# EAGLE schematic proper schematic (EAGLE 9.6.2)
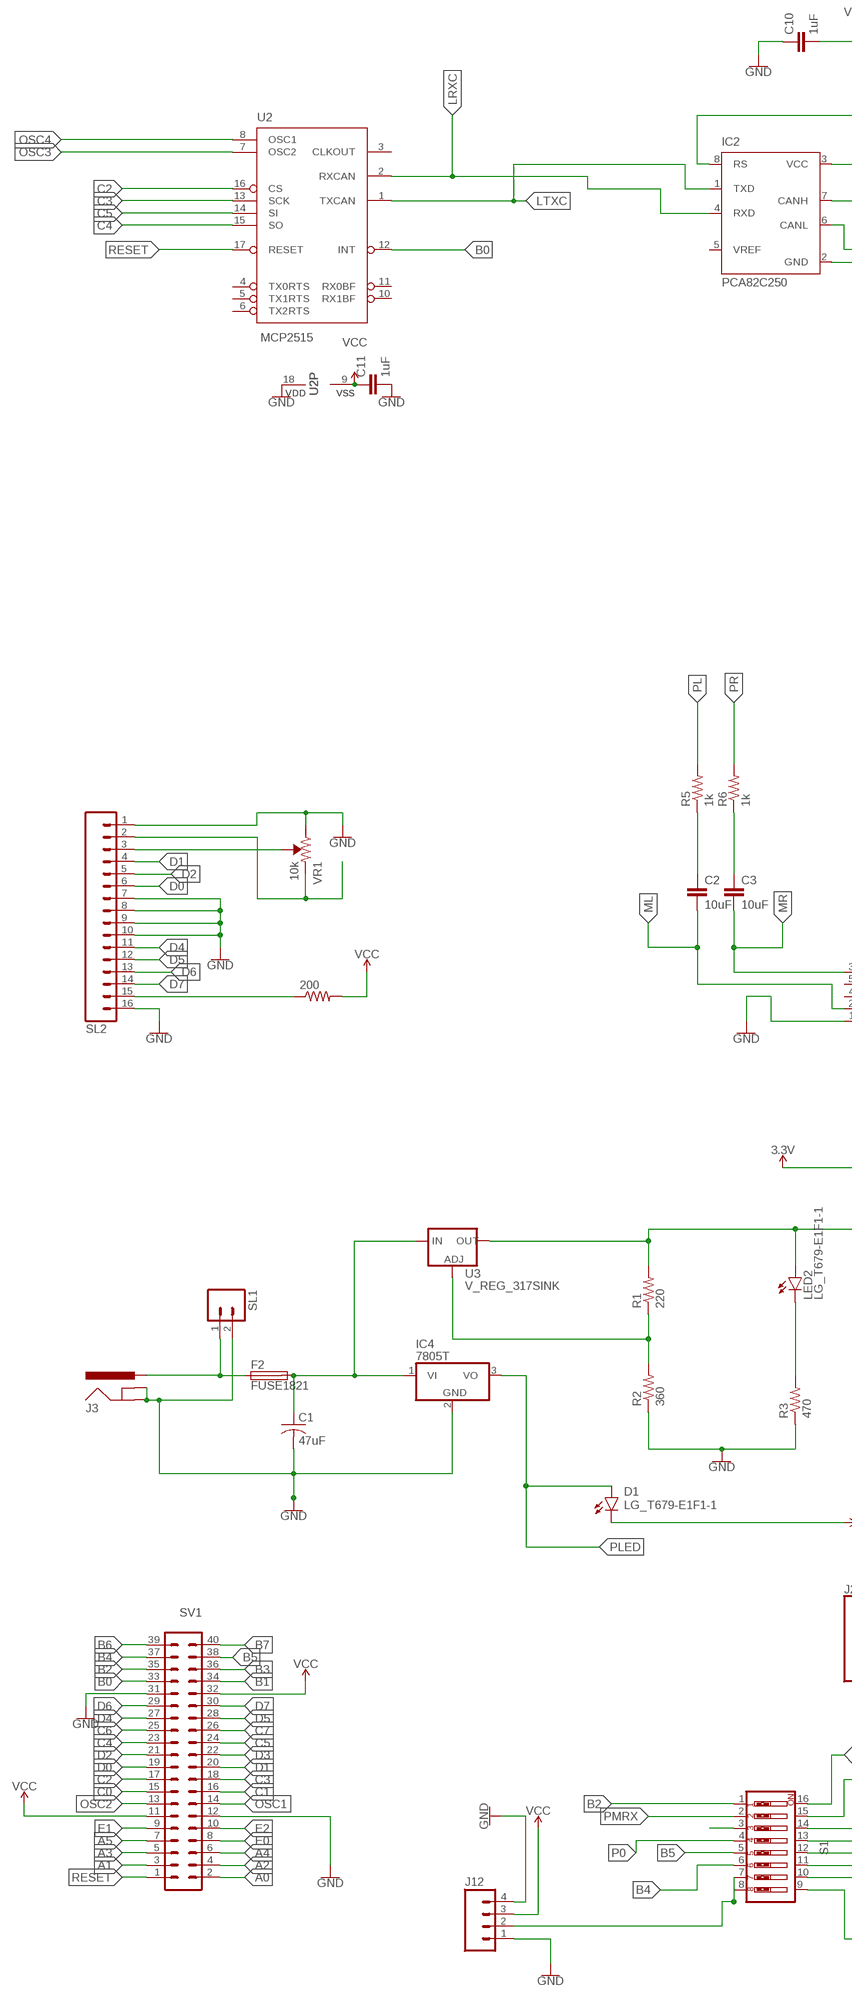
[diagram p0: schematic, sheet 1, part 1 of 2]
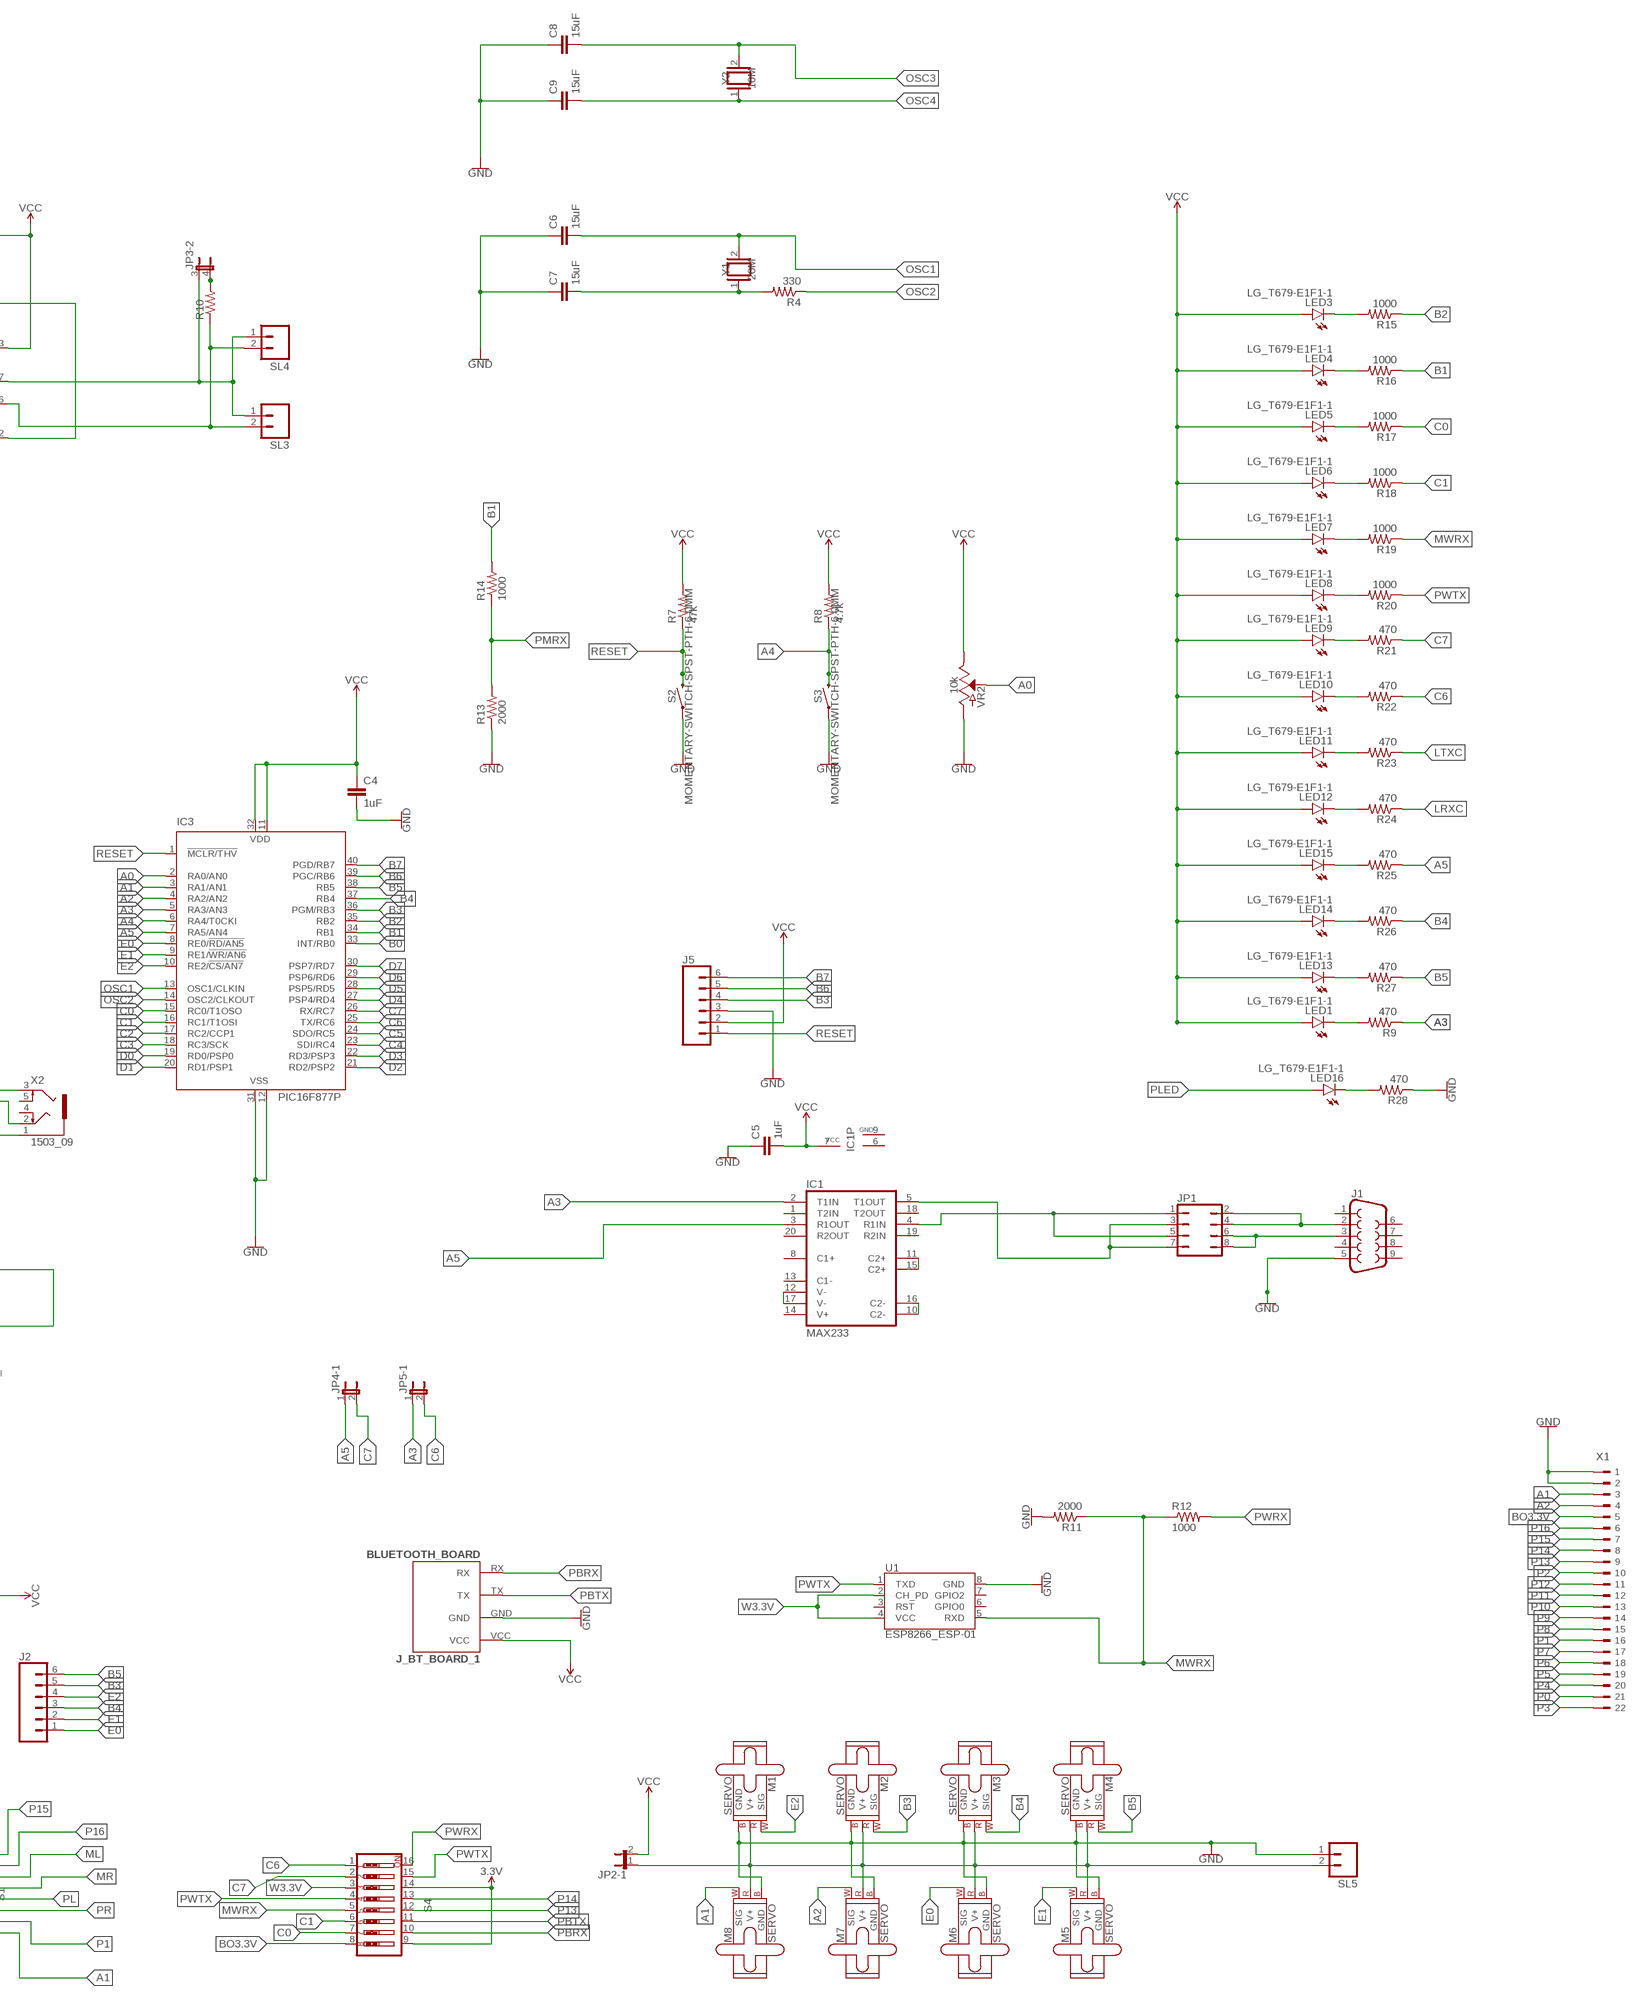
[diagram p1: schematic, sheet 1, part 2 of 2]

## Parts
200  R-US_0204/5  [0204/5]
C1  47uF  C-US025-025X050  [C025-025X050]
C2  10uF  C2,5-3  [C2.5-3]
C3  10uF  C2,5-3  [C2.5-3]
C4  1uF  C2,5-3  [C2.5-3]
C5  1uF  C2,5-3  [C2.5-3]
C6  15uF  C2,5-3  [C2.5-3]
C7  15uF  C2,5-3  [C2.5-3]
C8  15uF  C2,5-3  [C2.5-3]
C9  15uF  C2,5-3  [C2.5-3]
C10  1uF  C2,5-3  [C2.5-3]
C11  1uF  C2,5-3  [C2.5-3]
D1  LG_T679-E1F1-1  [PLCC2]
F2  FUSE1821  [FUSE_HOLDER_MENTOR-1821]
IC1  MAX233  [DIL20]
IC2  PCA82C250  [DIL08]
IC3  PIC16F877P  [DIL40]
IC4  7805T  [TO220H]
J1  DB9FEMALE  [DB9]
J2  CONN_062.5MM-6-90  [1X06_SCREW_TERMINAL_BLOCK]
J3  POWER_JACK  [POWER_JACK_PTH]
J5  CONN_062.5MM-6-90  [1X06_SCREW_TERMINAL_BLOCK]
J12  M04  [04P]
J_BT_BOARD_1  BLUETOOTH_BOARD  [BT_BOARD_FOOTPRINT]
JP1  JP4Q  [JP4Q]
JP2  JP2QE  [JP2Q]
JP3  JP2QE  [JP2Q]
JP4  JP2QE  [JP2Q]
JP5  JP2QE  [JP2Q]
LED1  LG_T679-E1F1-1  [PLCC2]
LED2  LG_T679-E1F1-1  [PLCC2]
LED3  LG_T679-E1F1-1  [PLCC2]
LED4  LG_T679-E1F1-1  [PLCC2]
LED5  LG_T679-E1F1-1  [PLCC2]
LED6  LG_T679-E1F1-1  [PLCC2]
LED7  LG_T679-E1F1-1  [PLCC2]
LED8  LG_T679-E1F1-1  [PLCC2]
LED9  LG_T679-E1F1-1  [PLCC2]
LED10  LG_T679-E1F1-1  [PLCC2]
LED11  LG_T679-E1F1-1  [PLCC2]
LED12  LG_T679-E1F1-1  [PLCC2]
LED13  LG_T679-E1F1-1  [PLCC2]
LED14  LG_T679-E1F1-1  [PLCC2]
LED15  LG_T679-E1F1-1  [PLCC2]
LED16  LG_T679-E1F1-1  [PLCC2]
M1  SERVO  [1X03]
M2  SERVO  [1X03]
M3  SERVO  [1X03]
M4  SERVO  [1X03]
M5  SERVO  [1X03]
M6  SERVO  [1X03]
M7  SERVO  [1X03]
M8  SERVO  [1X03]
R1  220  R-US_0204/5  [0204/5]
R2  360  R-US_0204/5  [0204/5]
R3  470  R-US_0204/5  [0204/5]
R4  330  R-US_0204/5  [0204/5]
R5  1k  R-US_0204/5  [0204/5]
R6  1k  R-US_0204/5  [0204/5]
R7  47k  R-US_0204/5  [0204/5]
R8  4.7k  R-US_0204/5  [0204/5]
R9  470  R-US_0204/5  [0204/5]
R10  R-US_0204/5  [0204/5]
R11  2000  R-US_0204/5  [0204/5]
R12  1000  R-US_0204/5  [0204/5]
R13  2000  R-US_0204/5  [0204/5]
R14  1000  R-US_0204/5  [0204/5]
R15  1000  R-US_0204/5  [0204/5]
R16  1000  R-US_0204/5  [0204/5]
R17  1000  R-US_0204/5  [0204/5]
R18  1000  R-US_0204/5  [0204/5]
R19  1000  R-US_0204/5  [0204/5]
R20  1000  R-US_0204/5  [0204/5]
R21  470  R-US_0204/5  [0204/5]
R22  470  R-US_0204/5  [0204/5]
R23  470  R-US_0204/5  [0204/5]
R24  470  R-US_0204/5  [0204/5]
R25  470  R-US_0204/5  [0204/5]
R26  470  R-US_0204/5  [0204/5]
R27  470  R-US_0204/5  [0204/5]
R28  470  R-US_0204/5  [0204/5]
S1  SW_DIP-8  [EDG-08]
S2  MOMENTARY-SWITCH-SPST-PTH-6.0MM  [TACTILE_SWITCH_PTH_6.0MM]
S3  MOMENTARY-SWITCH-SPST-PTH-6.0MM  [TACTILE_SWITCH_PTH_6.0MM]
S4  SW_DIP-8  [EDG-08]
SL1  M02  [02P]
SL2  M16  [16P]
SL3  M02  [02P]
SL4  M02  [02P]
SL5  M02  [02P]
SV1  MA20-2  [MA20-2]
U1  ESP8266_ESP-01  [ESP8266_ESP-01]
U2  MCP2515  MCP2515(MCP2510)P  [DIP18]
U3  V_REG_317SINK  [TO220-ADJ]
VR1  10k  TRIMPOT-PTH-10MM-KNOB-1/2W-10%  [TRIMPOT-PTH-3386U]
VR2  10k  POTENTIOMETER-PTH-9MM-1/20W-20%  [POT-PTH-ALPS]
X1  180G-22  [180G-22]
X2  1503_09  [1503_09]
Y1  20M  XTAL/S  [QS]
Y2  16M  XTAL/S  [QS]

## Nets
3.3V: LED2.A R1.2 S4.9 S4.14 U3.OUT
A0: IC3.2(RA0/AN0) SV1.2 VR2.P$2(S) VR2.P$3(A) ; supply symbol labelled GND
A1: IC3.3(RA1/AN1) M8.1(SIG) S1.9 SV1.3 X1.3
A2: IC3.4(RA2/AN2) M7.1(SIG) SV1.4 X1.4
A3: IC1.2(T1IN) IC3.5(RA3/AN3) JP5.1 R9.1 SV1.5
A4: IC3.6(RA4/T0CKI) R8.1 S3.3 SV1.6
A5: IC1.3(R1OUT) IC3.7(RA5/AN4) JP4.1 R25.1 SV1.7
B0: IC3.33(INT/RB0) SV1.33 U2.12(INT)
B1: IC3.34(RB1) R14.2 R16.1 SV1.34
B2: IC3.35(RB2) R15.1 S1.1 SV1.35
B3: IC3.36(PGM/RB3) J2.5 J5.4 M2.1(SIG) SV1.36
B4: IC3.37(RB4) J2.3 M3.1(SIG) R26.1 S1.6 SV1.37
B5: IC3.38(RB5) J2.6 M4.1(SIG) R27.1 S1.5 SV1.38
B6: IC3.39(PGC/RB6) J5.5 SV1.39
B7: IC3.40(PGD/RB7) J5.6 SV1.40
BO3.3V: S4.8 X1.5
C0: IC3.15(RC0/T1OSO) R17.1 S4.7 SV1.15
C1: IC3.16(RC1/T1OSI) R18.1 S4.6 SV1.16
C2: IC3.17(RC2/CCP1) SV1.17 U2.16(CS)
C3: IC3.18(RC3/SCK) SV1.18 U2.13(SCK)
C4: IC3.23(SDI/RC4) SV1.23 U2.15(SO)
C5: IC3.24(SDO/RC5) SV1.24 U2.14(SI)
C6: IC3.25(TX/RC6) JP5.2 R22.1 S4.1 SV1.25
C7: IC3.26(RX/RC7) JP4.2 R21.1 S4.2 SV1.26
D0: IC3.19(RD0/PSP0) SL2.6 SV1.19
D1: IC3.20(RD1/PSP1) SL2.4 SV1.20
D2: IC3.21(RD2/PSP2) SL2.5 SV1.21
D3: IC3.22(RD3/PSP3) SV1.22
D4: IC3.27(PSP4/RD4) SL2.11 SV1.27
D5: IC3.28(PSP5/RD5) SL2.12 SV1.28
D6: IC3.29(PSP6/RD6) SL2.13 SV1.29
D7: IC3.30(PSP7/RD7) SL2.14 SV1.30
E0: IC3.8(RE0/!RD/AN5) J2.1 M6.1(SIG) SV1.8
E1: IC3.9(RE1/!WR/AN6) J2.2 M5.1(SIG) SV1.9
E2: IC3.10(RE2/!CS/AN7) J2.4 M1.1(SIG) SV1.10
GND: C1.2 C4.2 C5.1 C6.1 C7.1 C8.1 C9.1 C10.1 C11.2 IC3.12(VSS) IC3.31(VSS) IC4.2(GND) J1.5 J3.GND J3.GNDBREAK J5.3 J12.1 J12.4 J_BT_BOARD_1.GND M1.3(GND) M2.3(GND) M3.3(GND) M4.3(GND) M5.3(GND) M6.3(GND) M7.3(GND) M8.3(GND) R2.1 R3.1 R11.2 R13.1 R28.1 S2.1 S3.1 SL1.2 SL2.1 SL2.7 SL2.8 SL2.9 SL2.10 SL2.16 SL5.1 SV1.12 SV1.31 U1.8(GND) U2.18(VDD) VR1.3(CW) X1.1 X1.2 X2.1
LRXC: IC2.4(RXD) R24.1 U2.2(RXCAN)
LTXC: IC2.1(TXD) R23.1 U2.1(TXCAN)
ML: C2.2 S1.14 X2.2
MR: C3.2 S1.13 X2.3
MWRX: R11.1 R12.1 R19.1 S4.5 U1.5(RXD)
N$1: LED1.C R9.2
N$2: S1.3
N$5: JP3.4 R10.2
N$6: IC1.10(C2-) IC1.16(C2-)
N$7: C1.1 F2.B IC4.1(VI) U3.IN
N$9: F2.A J3.PWR SL1.1
N$10: R1.1 R2.2 U3.ADJ
N$12: LED2.C R3.2
N$14: IC1.5(T1OUT) JP1.3 JP1.7
N$15: IC1.4(R1IN) JP1.1 JP1.5
N$16: J1.3 JP1.6 JP1.8
N$18: J1.2 JP1.2 JP1.4
N$21: C2.1 R5.1
N$22: IC1.12(V-) IC1.17(V-)
N$23: IC1.11(C2+) IC1.15(C2+)
N$24: C3.1 R6.1
N$27: 200.1 SL2.15
N$28: C7.2 R4.2 Y1.1
N$29: SL2.3 VR1.2(WIPER)
N$30: SL2.2 VR1.1(CCW)
N$32: JP2.1 M1.2(V+) M2.2(V+) M3.2(V+) M4.2(V+) M5.2(V+) M6.2(V+) M7.2(V+) M8.2(V+) SL5.2
N$39: J12.2 S1.7 S1.8
N$42: IC2.2(GND) IC2.8(RS)
N$44: IC2.6(CANL) R10.1 SL3.2 SL4.2
N$45: IC2.7(CANH) JP3.3 SL3.1 SL4.1
N$47: LED3.C R15.2
N$50: LED4.C R16.2
N$52: LED5.C R17.2
N$53: LED6.C R18.2
N$55: LED7.C R19.2
N$57: LED8.C R20.2
N$59: LED9.C R21.2
N$61: LED10.C R22.2
N$63: LED11.C R23.2
N$65: LED12.C R24.2
N$67: LED15.C R25.2
N$69: LED14.C R26.2
N$71: LED13.C R27.2
N$73: LED16.C R28.2
OSC1: C6.2 IC3.13(OSC1/CLKIN) SV1.14 Y1.2
OSC2: IC3.14(OSC2/CLKOUT) R4.1 SV1.13
OSC3: C8.2 U2.7(OSC2) Y2.2
OSC4: C9.2 U2.8(OSC1) Y2.1
P0: S1.4 X1.21
P1: S1.10 X1.16
P2: X1.10
P3: X1.22
P4: X1.20
P5: X1.19
P6: X1.18
P7: X1.17
P8: X1.15
P9: X1.14
P10: X1.13
P11: X1.12
P12: X1.11
P13: S4.12 X1.9
P14: S4.13 X1.8
P15: S1.16 X1.7
P16: S1.15 X1.6
PBRX: J_BT_BOARD_1.RX S4.10
PBTX: J_BT_BOARD_1.TX S4.11
PL: R5.2 S1.12
PLED: D1.A IC4.3(VO) LED16.A
PMRX: R13.2 R14.1 S1.2
PR: R6.2 S1.11
PWRX: R12.2 S4.16
PWTX: R20.1 S4.4 S4.15 U1.1(TXD)
RESET: IC3.1(!MCLR/THV) J5.1 R7.1 S2.3 SV1.1 U2.17(RESET)
VCCA: 200.2 C4.1 C5.2 C10.2 C11.1 D1.C IC1.7(VCC) IC2.3(VCC) IC3.11(VDD) IC3.32(VDD) J5.2 J12.3 J_BT_BOARD_1.VCC JP2.2 LED1.A LED3.A LED4.A LED5.A LED6.A LED7.A LED8.A LED9.A LED10.A LED11.A LED12.A LED13.A LED14.A LED15.A R7.2 R8.2 SV1.11 SV1.32 U2.9(VSS) VR2.P$1(E) ; supply symbol labelled VCC
W3.3V: S4.3 U1.2(CH_PD) U1.4(VCC)
Unconnected: IC1.1(T2IN) IC1.8(C1+) IC1.13(C1-) IC1.14(V+) IC1.18(T2OUT) IC1.19(R2IN) IC1.20(R2OUT) IC2.5(VREF) J1.1 J1.4 J1.6 J1.7 J1.8 J1.9 JP2.3 JP2.4 JP3.1 JP3.2 JP4.3 JP4.4 JP5.3 JP5.4 U1.3(RST) U1.6(GPIO0) U1.7(GPIO2) U2.3(CLKOUT) U2.4(TX0RTS) U2.5(TX1RTS) U2.6(TX2RTS) U2.10(RX1BF) U2.11(RX0BF) X2.4 X2.5

## Power pins joined to a net without a drawn wire
GND: IC1.6(GND) IC1.9(GND)

## Library data of the parts
200 R1-R28 = rcl:R-US_: RESISTOR, American symbol; SPICEPREFIX: R
C1 = rcl:C-US: CAPACITOR, American symbol; SPICEPREFIX: C
C2-C11 = capacitor-wima:C: CAPACITOR naming: grid - package width
D1 LED1-LED16 = led:*_T679-?-1: LC TOPLED® Low Current LED Source: http://catalog.osram-os.com .. LG_LS_LY_T679_OBS.pdf; COLOR: green
F2 = fuse:FUSE: Fuse; OC_FARNELL: unknown; OC_NEWARK: unknown
IC1 = maxim:MAX233: RS232 TRANSCEIVER; MPN: MAX233ACPP+G36; OC_FARNELL: 1593332; OC_NEWARK: 89K3459
IC2 = micro-philips:PCA82C250: CAN CONTROLLER INTERFACE; OC_FARNELL: 3692358; OC_NEWARK: unknown
IC3 = microchip:PIC16F87*: MICROCONTROLLER; MF: MICROCHIP; MPN: PIC16F877-04/P; OC_FARNELL: 9761349; OC_NEWARK: 61K3463
IC4 = linear:78*: Positive VOLTAGE REGULATOR Source: http://cache.national.com/ds/LM/LM78L05.pdf http://www.fairchildsemi.com/ds/LM/LM7805.pdf
J1 = SparkFun-Connectors:DB9: DB9 Connector Standard DB9 (D-Sub 9) serial connector. Can be used for CAN bus as well as RS485 and RS232. Footprint production proven. Here is the female version connector we sell at SparkFun: 9 Pin Female Serial Connector - PCB Mount <https://www.sparkfun.com/products/429> (PRT-00429) This connector has been used on the following SparkFun products: SparkFun RS232 Shifter - SMD <https://www.sparkfun.com/products/449> (PRT-00449) SparkFun RS232 Shifter SMD (No DB9) <https://www.sparkfun.com/products/8780> (PRT-08780); PROD_ID: CONN-08194
J2 J5 = SparkFun-Connectors:CONN_06: Multi connection point. Often used as Generic Header-pin footprint for 0.1 inch spaced/style header connections On any of the 0.1 inch spaced packages, you can populate with these: Break Away Headers - Straight <https://www.sparkfun.com/products/116> (PRT-00116) Break Away Male Headers - Right Angle <https://www.sparkfun.com/products/553> (PRT-00553) Female Headers <https://www.sparkfun.com/products/115> (PRT-00115) Break Away Headers - Machine Pin <https://www.sparkfun.com/products/117> (PRT-00117) Break Away Female Headers - Swiss Machine Pin <https://www.sparkfun.com/products/743> (PRT-00743) Arduino Stackable Header - 6 Pin <https://www.sparkfun.com/products/9280> (PRT-09280) Screw Terminals 2.54mm Pitch (6-Pin) <https://www.sparkfun.com/products/16499> (PRT-16499) For SCREWTERMINALS and SPRING TERMINALS visit here: Screw Terimnals on SparkFun.com <https://www.sparkfun.com/search/results?term=Screw+Terminals> (5mm/3.5mm/2.54mm spacing) This device is also useful as a general connection point to wire up your design to another part of your project. Our various solder wires solder well into these plated through hole pads. Hook-Up Wire - Assortment (Stranded, 22 AWG) <https://www.sparkfun.com/products/11375> (PRT-11375) Hook-Up Wire - Assortment (Solid Core, 22 AWG) <https://www.sparkfun.com/products/11367> (PRT-11367) View the entire wire category on our website here <https://www.sparkfun.com/categories/141>
J3 = SparkFun-Connectors:POWER_JACK: Power Jack Connector This is the standard 5.5mm barrel jack for power. The PTH is the most common, proven, reliable, footprint. The Slot footprint only works if the mill layer is transmitted to the PCB fab house so be warned. Here are the connectors we sell at SparkFun: DC Barrel Power Jack/Connector <https://www.sparkfun.com/products/119> (PRT-00119) DC Barrel Power Jack/Connector (SMD) <https://www.sparkfun.com/products/12748> (PRT-12748) DC Barrel Jack Adapter - Breadboard Compatible <https://www.sparkfun.com/products/10811> (PRT-10811) It is used on this SparkFun product (and many, many others): SparkFun RedBoard - Programmed with Arduino <https://www.sparkfun.com/products/12757> (DEV-12757) Also, if you need a mating power supply or connector, please check these out: Wall Adapter Power Supply - 9VDC 650mA <https://www.sparkfun.com/products/298> (TOL-00298) DC Barrel Jack Adapter - Male <https://www.sparkfun.com/products/10287> (PRT-10287); PROD_ID: CONN-08197
J12 = con-amp-quick:M04: AMP QUICK CONNECTOR; OC_FARNELL: unknown; OC_NEWARK: unknown
J_BT_BOARD_1 = bluetooth:BLUETOOTH_BOARD: Bluetooth Board V1.05
JP1 = jumper:JP4Q: JUMPER
JP2-JP5 = jumper:JP2QE: JUMPER
M1-M8 = SparkFun-Electromechanical:SERVO: Servo Motor 3-pin connector for a standard servo motor (voltage supply, ground, and control signal.) SparkFun Products Servo - Generic (Sub-Micro Size) <https://www.sparkfun.com/products/9065> (ROB-09065) Servo - Generic High Torque Continuous Rotation (Standard Size) <https://www.sparkfun.com/products/9347> (ROB-09347) Servo - Generic High Torque (Standard Size) <https://www.sparkfun.com/products/11965> (ROB-11965)
S1 S4 = special:SW_DIP-8: DIP SWITCH
S2 S3 = SparkFun-Switches:MOMENTARY-SWITCH-SPST: Momentary Switch (Pushbutton) - SPST Normally-open (NO) SPST momentary switches (buttons, pushbuttons). Variants PTH-12MM - 12mm square, through-hole Momentary Pushbutton Switch - 12mm Square <https://www.sparkfun.com/products/9190> (COM-09190) PTH-6.0MM, PTH-6.0MM-KIT - 6.0mm square, through-hole Mini Pushbutton Switch <https://www.sparkfun.com/products/97> (COM-00097) KIT package intended for soldering kit's - only one side of pads' copper is exposed. PTH-RIGHT-ANGLE-KIT - Right-angle, through-hole Right Angle Tactile Button <https://www.sparkfun.com/products/10791> - Used on SparkFun BigTime Watch Kit <https://www.sparkfun.com/products/11734> SMD-12MM - 12mm square, surface-mount Tactile Button - SMD (12mm) <https://www.sparkfun.com/products/12993> (COM-12993) Used on SparkFun PicoBoard <https://www.sparkfun.com/products/11888> SMD-4.5MM - 4.5mm Square Trackball Switch Used on SparkFun Blackberry Trackballer Breakout <https://www.sparkfun.com/products/13169> SMD-4.6MMX2.8MM - 4.60mm x 2.80mm, surface mount Used on SparkFun Pro Micro - RP2040 <https://www.sparkfun.com/products/17717> SMD-5.2MM, SMD-5.2-REDUNDANT - 5.2mm square, surface-mount Mini Pushbutton Switch - SMD <https://www.sparkfun.com/products/8720> (COM-08720) Used on Arduino Pro Mini <https://www.sparkfun.com/products/11114> REDUNDANT package connects both switch circuits together SMD-6.0X3.5MM - 6.0 x 3.5mm, surface mount Momentary Reset Switch SMD <https://www.sparkfun.com/products/8229> (COM-08229) SMD-6.2MM-TALL - 6.2mm square, surface mount Tactile Button - SMD (6mm) <https://www.sparkfun.com/products/12992> Used on SparkFun Digital Sandbox <https://www.sparkfun.com/products/12651> SMD-RIGHT-ANGLE - Right-angle, surface mount Used on SparkFun Block for Intel® Edison - Arduino <https://www.sparkfun.com/products/13036>; PROD_ID: SWCH-08441; SF_SKU: COM-00097
SL1 SL3-SL5 = con-amp-quick:M02: AMP QUICK CONNECTOR; OC_FARNELL: unknown; OC_NEWARK: unknown
SL2 = con-amp-quick:M16: AMP QUICK CONNECTOR; OC_FARNELL: unknown; OC_NEWARK: unknown
SV1 = con-lstb:MA20-2: PIN HEADER; OC_FARNELL: unknown; OC_NEWARK: unknown
U1 = SparkFun-RF:ESP8266_ESP-01: ESP8266 ESP-01 Module The ESP8266 WiFi Module is a self contained SOC with integrated TCP/IP protocol stack that can give any microcontroller access to your WiFi network. The ESP8266 is capable of either hosting an application or offloading all Wi-Fi networking functions from another application processor. Each ESP8266 module comes pre-programmed with an AT command set firmware, meaning, you can simply hook this up to your Arduino device and get about as much WiFi-ability as a WiFi Shield offers (and that’s just out of the box)! The ESP8266 module is an extremely cost effective board with a huge, and ever growing, community. This module has a powerful enough on-board processing and storage capability that allows it to be integrated with the sensors and other application specific devices through its GPIOs with minimal development up-front and minimal loading during runtime. Its high degree of on-chip integration allows for minimal external circuitry, including the front-end module, is designed to occupy minimal PCB area. The ESP8266 supports APSD for VoIP applications and Bluetooth co-existance interfaces, it contains a self-calibrated RF allowing it to work under all operating conditions, and requires no external RF parts. SparkFun Product Page <https://www.sparkfun.com/products/13678>; SF_ID: WRL-13678
U2 = SparkFun-IC-Comms:MCP2515(MCP2510): CAN controller with SPI interface The MCP2515 controller supercedes the MCP2510 while addressing all errata associated with it. The two devices are pin compatible, either can be used with this device. 18-pin package SOIC Simple SPI interface to any MCU. One-shot mode ensures message transmission is attempted only once Databyte filtering Start-of-Frame (SOF) output Low-power CMOS Technology Datasheet <http://www.sparkfun.com/datasheets/DevTools/Arduino/MCP2515.pdf> SparkFun Products CAN-BUS Shield <https://www.sparkfun.com/products/13262> (DEV-13262); PROD_ID: NA-XXXXX
U3 = SparkFun-IC-Power:V_REG_317: Voltage Regulator Standard LM317 adjustable voltage regulator. AOI (Adjust Output Input). Google 'LM317 Calculator' for easy to use app to get the two resistor values needed. 240/720 for 5V output. 240/390 for 3.3V output. Spark Fun Electronics SKU : COM-00527
VR1 = SparkFun-Resistors:TRIMPOT: Trimming Potentiometer (Trimpot) Three-terminal potentiometers, with an adjustable wiper and two adjustable resistors. A pot can be used to create a configurable voltage divider, or as a variable resistor. "Trimpots" are a subset of potentiometers, usually intended for "set-and-forget" applications. They're often more delicate than standard potentiometers - rated for fewer turns. Variants PTH-KNOB - PTH Trimpot w/ finger-adjustable knob Trimpot 10K with Knob <https://www.sparkfun.com/products/9806> (COM-09806) Datasheet <http://www.sparkfun.com/datasheets/Components/General/TSR-3386.pdf> SMD-3MM-CLOSED-FRAME - SMD 3mm Square Closed-Frame Trimpot Used on e.g. EasyDriver - Stepper Motor Driver <https://www.sparkfun.com/products/12779> Datasheet <http://www.bitechnologies.com/pdfs/22.pdf> (22AR10KTR) SMD-5MM - SMD 5mm Square Closed-Frame Trimpot Used on e.g. IOIO-OTG - V2.2 <https://www.sparkfun.com/products/13613> Datasheet <http://www.vishay.com/docs/51008/ts53.pdf> (TS53YL502MR10) SMD-3MM-1/10W-25% - 3mm Square Open-Frame Trimpot Used on e.g. SparkFun Shapeoko <https://www.sparkfun.com/products/13899> Datasheet <http://www.bourns.com/docs/Product-Datasheets/TC33.pdf> (TC33X-2-103E); PROD_ID: RES-09730; SF_SKU: COM-09806
VR2 = SparkFun-Resistors:POTENTIOMETER: Potentiometer (Pot) Three-terminal potentiometers, with an adjustable wiper and two adjustable resistors. A pot can be used to create a configurable voltage divider, or as a variable resistor. Variants ALPS_POT and ALPS_POT_KIT - PTH, breadboard compatible, 9mm square pots Rotary Potentiometer - Linear (10k ohm) <https://www.sparkfun.com/products/9288> (COM-09288) The KIT variant exposes copper on only one side of the PTH pad, so the part can only be assembled on one side of the PCB. Useful for beginner soldering kits.; PROD_ID: RES-09177; SF_SKU: COM-09288
X1 = con-weidmueller-sl35:180G-22: WEIDMUELLER CLAMP CONNECTOR; OC_FARNELL: unknown; OC_NEWARK: unknown
X2 = con-lumberg:1503_09: Jack connectors according to JISC 6560, 3.5 mm Klinkeneinbaukupplung nach JISC 6560, 3,5 mm, 3-polig/ stereo, abgewinkelte Ausführung, mit 2 Öffnern und Lötaugen, für Leiterplatten Rückseitenmontage Source: http://www.lumberg.com/Produkte/PDFs/1503_09.pdf; OC_FARNELL: 1243244; OC_NEWARK: unknown
Y1 Y2 = special:XTAL/S: CRYSTAL